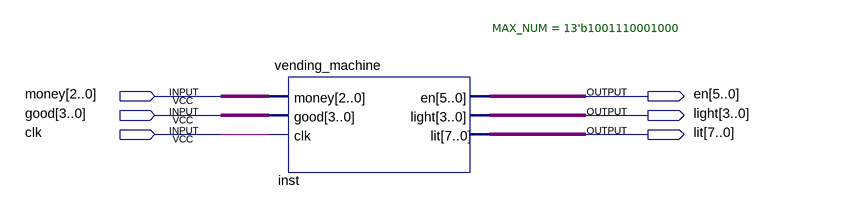
[diagram p0: schematic sheet]
// Quartus schematic Block1.bdf as structural Verilog: 1 symbols, 6 pins
module Block1 (
  input  [2:0] money,
  input  [3:0] good,
  input  clk,
  output [5:0] en,
  output [3:0] light,
  output [7:0] lit
);

  vending_machine #(.MAX_NUM(13'b1001110001000)) inst (
    .money(money), .good(good), .clk(clk), .en(en), .light(light), .lit(lit));
endmodule
